# Altium schematic sheet Robo2.SchDoc
size A; SheetNumber: 2; SheetTotal: 2
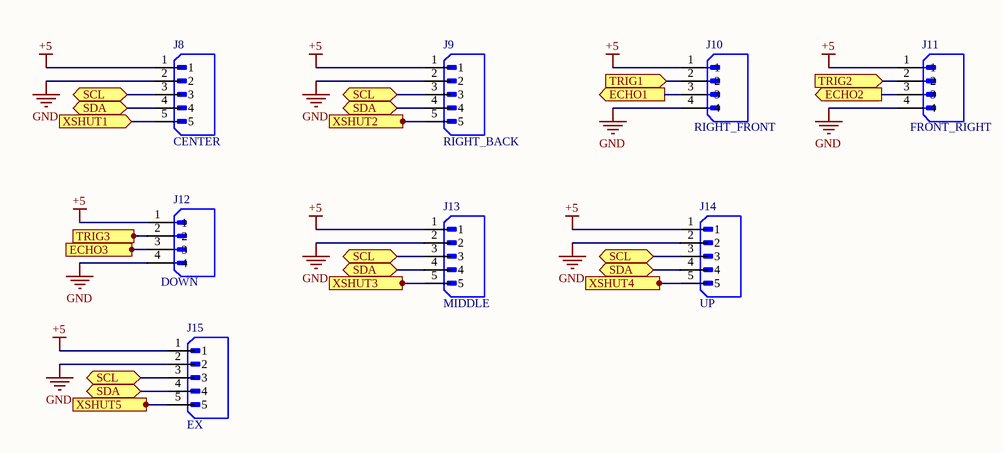
[diagram p0: Robo2.SchDoc]

## Parts
J8  CENTER  [JST_B5B-XH-A(LF)(SN)]
J9  RIGHT_BACK  [JST_B5B-XH-A(LF)(SN)]
J10  RIGHT_FRONT  [JST_B4B-XH-A(LF)(SN)]
J11  FRONT_RIGHT  [JST_B4B-XH-A(LF)(SN)]
J12  DOWN  [JST_B4B-XH-A(LF)(SN)]
J13  MIDDLE  [JST_B5B-XH-A(LF)(SN)]
J14  UP  [JST_B5B-XH-A(LF)(SN)]
J15  EX  [JST_B5B-XH-A(LF)(SN)]

## Ports
ECHO1 (out, see Robo[3B]), ECHO2 (out, see Robo[3B]), ECHO3 (out, see Robo[3B]), SCL (bidir, see Robo2[1A], Robo2[1B], Robo2[2A], Robo2[2B], Robo[3A]), SCL (bidir, see Robo2[1A], Robo2[1B], Robo2[2A], Robo2[3B], Robo[3A]), SCL (bidir, see Robo2[1A], Robo2[1B], Robo2[2B], Robo2[3B], Robo[3A]), SCL (bidir, see Robo2[1A], Robo2[2A], Robo2[2B], Robo2[3B], Robo[3A]), SCL (bidir, see Robo2[1B], Robo2[2A], Robo2[2B], Robo2[3B], Robo[3A]), SDA (bidir, see Robo2[1A], Robo2[1B], Robo2[2A], Robo2[2B], Robo[3A]), SDA (bidir, see Robo2[1A], Robo2[1B], Robo2[2A], Robo2[3B], Robo[3A]), SDA (bidir, see Robo2[1A], Robo2[1B], Robo2[2B], Robo2[3B], Robo[3A]), SDA (bidir, see Robo2[1A], Robo2[2A], Robo2[2B], Robo2[3B], Robo[3A]), SDA (bidir, see Robo2[1B], Robo2[2A], Robo2[2B], Robo2[3B], Robo[3A]), TRIG1 (in, see Robo[2C]), TRIG2 (in, see Robo[2B]), TRIG3 (in, see Robo[2B]), XSHUT1 (in, see Robo[3B]), XSHUT2 (in, see Robo[3B]), XSHUT3 (in, see Robo[3B]), XSHUT4 (in, see Robo[3B]), XSHUT5 (in, see Robo[3B])

## Nets
+5: J8.1 J9.1 J10.1 J11.1 J12.1 J13.1 J14.1 J15.1
GND: J8.2 J9.2 J10.4 J11.4 J12.4 J13.2 J14.2 J15.2
ECHO1: J10.3 ; port ECHO1
ECHO2: J11.3 ; port ECHO2
ECHO3: J12.3 ; port ECHO3
SCL: J8.3 J9.3 J13.3 J14.3 J15.3 ; port SCL
SDA: J8.4 J9.4 J13.4 J14.4 J15.4 ; port SDA
TRIG1: J10.2 ; port TRIG1
TRIG2: J11.2 ; port TRIG2
TRIG3: J12.2 ; port TRIG3
XSHUT1: J8.5 ; port XSHUT1
XSHUT2: J9.5 ; port XSHUT2
XSHUT3: J13.5 ; port XSHUT3
XSHUT4: J14.5 ; port XSHUT4
XSHUT5: J15.5 ; port XSHUT5

## Library data of the parts
J8 J9 J13-J15 = B5B-XH-A(LF)(SN): Connector Header Through Hole 5 position 0.098 (2.50mm); MF: JST Sales America Inc.; SnapEDA_Link: https://www.snapeda.com/parts/B5B-XH-A(LF)(SN)/JST+Sales+America+Inc./view-part/?ref=snap; Package: None; Value: *; MP: B5B-XH-A(LF)(SN); Check_prices: https://www.snapeda.com/parts/B5B-XH-A(LF)(SN)/JST+Sales+America+Inc./view-part/?ref=eda
J10-J12 = B4B-XH-A(LF)(SN): Connector Header Through Hole 4 position 0.098 (2.50mm); MF: JST Sales; SnapEDA_Link: https://www.snapeda.com/parts/B4B-XH-A(LF)(SN)/JST+Sales+America+Inc./view-part/?ref=snap; Package: None; MP: B4B-XH-A(LF)(SN); Check_prices: https://www.snapeda.com/parts/B4B-XH-A(LF)(SN)/JST+Sales+America+Inc./view-part/?ref=eda; Purchase-URL: https://pricing.snapeda.com/search/part/B4B-XH-A(LF)(SN)/?ref=eda; Price: None; Value: *; Availability: In Stock